# Altium schematic sheet CHM_CPU_FPGA_EX.SchDoc: ASIM MXGS PSU Controller
size A4; Author: Andrzej Cichocki; Organization: Space Research Centre; Address1: Bartycka 18a; Address2: 00-716 Warsaw; Address3: Poland; Revision: 1; ModuleName: MainBoard Main; SubOrganization1: FPGA Space Applications Lab.
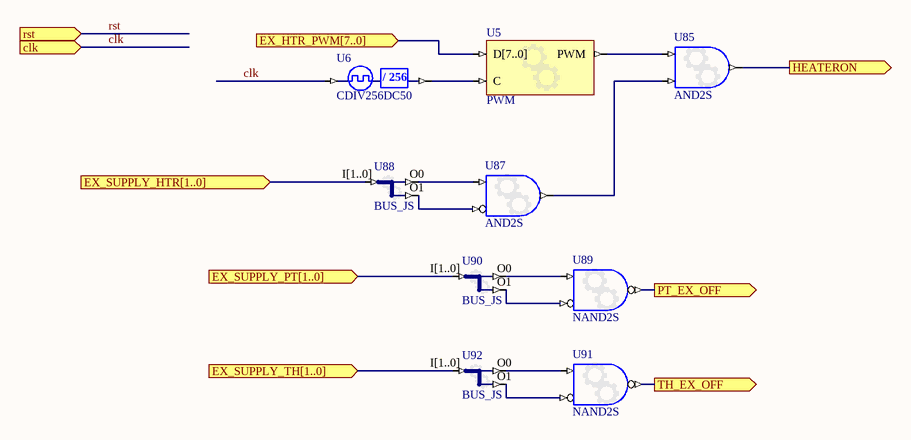
[diagram p0: CHM_CPU_FPGA_EX.SchDoc]

## Parts
U5  PWM
U6  CDIV256DC50
U85  AND2S
U87  AND2S
U88  BUS_JS
U89  NAND2S
U90  BUS_JS
U91  NAND2S
U92  BUS_JS

## Ports
clk (in), EX_HTR_PWM[7..0] (in), EX_SUPPLY_HTR[1..0] (in), EX_SUPPLY_PT[1..0] (in), EX_SUPPLY_TH[1..0] (in), HEATERON (out), PT_EX_OFF (out), rst (in), TH_EX_OFF (out)

## Nets
clk: U6.CLKIN ; port clk
EX_HTR_PWM[7..0]: U5.D[7..0] ; port EX_HTR_PWM[7..0]
EX_SUPPLY_HTR[1..0]: U88.I[1..0] ; port EX_SUPPLY_HTR[1..0]
EX_SUPPLY_PT[1..0]: U90.I[1..0] ; port EX_SUPPLY_PT[1..0]
EX_SUPPLY_TH[1..0]: U92.I[1..0] ; port EX_SUPPLY_TH[1..0]
HEATERON: U85.O ; port HEATERON
PT_EX_OFF: U89.O ; port PT_EX_OFF
rst: port rst
TH_EX_OFF: U91.O ; port TH_EX_OFF
NetU5_C: U5.C U6.CLKDV
NetU5_PWM: U5.PWM U85.I0
NetU85_I1: U85.I1 U87.O
NetU87_I0: U87.I0 U88.O0
NetU87_I1: U87.I1 U88.O1
NetU89_I0: U89.I0 U90.O0
NetU89_I1: U89.I1 U90.O1
NetU91_I0: U91.I0 U92.O0
NetU91_I1: U91.I1 U92.O1

## Notes on the sheet
- Module:
- Project:
- Modified:
- Rev.:
- Author:
- (in symbol CDIV256DC50) / 256

## Library data of the parts
U5 = PWM: Configurable PWM; ConfiguratorName: GENERIC_PWM; ConfigurationParameters: {}Version[1.0]{}Width[8]{}Prescaler[1]{}; LastRevisionNo: 1.00.00; Published: 8-Apr-2009; Publisher: Altium Limited; HelpURL: https://wiki.altium.com/display/ADOH/New+Configurable+Generic+FPGA+Logic+Components
U6 = CDIV256DC50: Clock Divider by 256 with 50% Duty Cycle Output; DivisorRate: 256; DutyCycle: 50; ArchiveName: GENERIC; VHDLIB_SIM: GENERIC_LIB; Published: 29-Jan-2004; Publisher: Altium Limited; LastRevisionNo: 1.00.00; HelpURL: CR0118 FPGA Generic Library Guide.pdf#page=143; ComponentLink1URL: CR0127 FPGA Clock Divider Resource Usage.pdf#page=31; ComponentLink1Description: Core &Resource Usage; FunctionalClass: Clock Divider
U85 = GATE: Configurable Generic Gate; ConfiguratorName: GENERIC_GATE; ConfigurationParameters: {}Version[1.1]{}GateKind[AND]{}BusInput[False]{}GateInputType[Bit]{}GateOutputOption[Normal]{}BusWidth[8]{}RegisterOutputs[False]{}NegativeClockEdge[False]{}InputCount[2]{}InputInvert0[False]{}InputInvert1[False]{}; LastRevisionNo: 1.00.00; Published: 3-Sep-2008; Publisher: Altium Limited; HelpURL: https://wiki.altium.com/display/ADOH/Configurable+Generic+Library
U87 = GATE: Configurable Generic Gate; ConfiguratorName: GENERIC_GATE; ConfigurationParameters: {}Version[1.1]{}GateKind[AND]{}BusInput[False]{}GateInputType[Bit]{}GateOutputOption[Normal]{}BusWidth[8]{}RegisterOutputs[False]{}NegativeClockEdge[False]{}InputCount[2]{}InputInvert0[False]{}InputInvert1[True]{}; LastRevisionNo: 1.00.00; Published: 3-Sep-2008; Publisher: Altium Limited; HelpURL: https://wiki.altium.com/display/ADOH/Configurable+Generic+Library
U88 U90 U92 = BUS_JS: Configurable Bus Joiner/Splitter; ConfiguratorName: GENERIC_BUS_JS; ConfigurationParameters: {}Version[1.1]{}SplitterJoinerType[Splitter]{}SignalCount[2]{}SignalWidth0[1]{}GapBelow0[1000000]{}ConnectionType0[Pin]{}SignalWidth1[1]{}GapBelow1[1000000]{}ConnectionType1[Pin]{}ShowPinNames[True]{}; LastRevisionNo: 1.00.00; Published: 17-Sep-2008; Publisher: Altium Limited; HelpURL: https://wiki.altium.com/display/ADOH/Configurable+Generic+Library
U89 U91 = GATE: Configurable Generic Gate; ConfiguratorName: GENERIC_GATE; ConfigurationParameters: {}Version[1.1]{}GateKind[NAND]{}BusInput[False]{}GateInputType[Bit]{}GateOutputOption[Normal]{}BusWidth[8]{}RegisterOutputs[False]{}NegativeClockEdge[False]{}InputCount[2]{}InputInvert0[False]{}InputInvert1[True]{}; LastRevisionNo: 1.00.00; Published: 3-Sep-2008; Publisher: Altium Limited; HelpURL: https://wiki.altium.com/display/ADOH/Configurable+Generic+Library